# EAGLE design trackduino1309111914 (EAGLE 7.1.0)
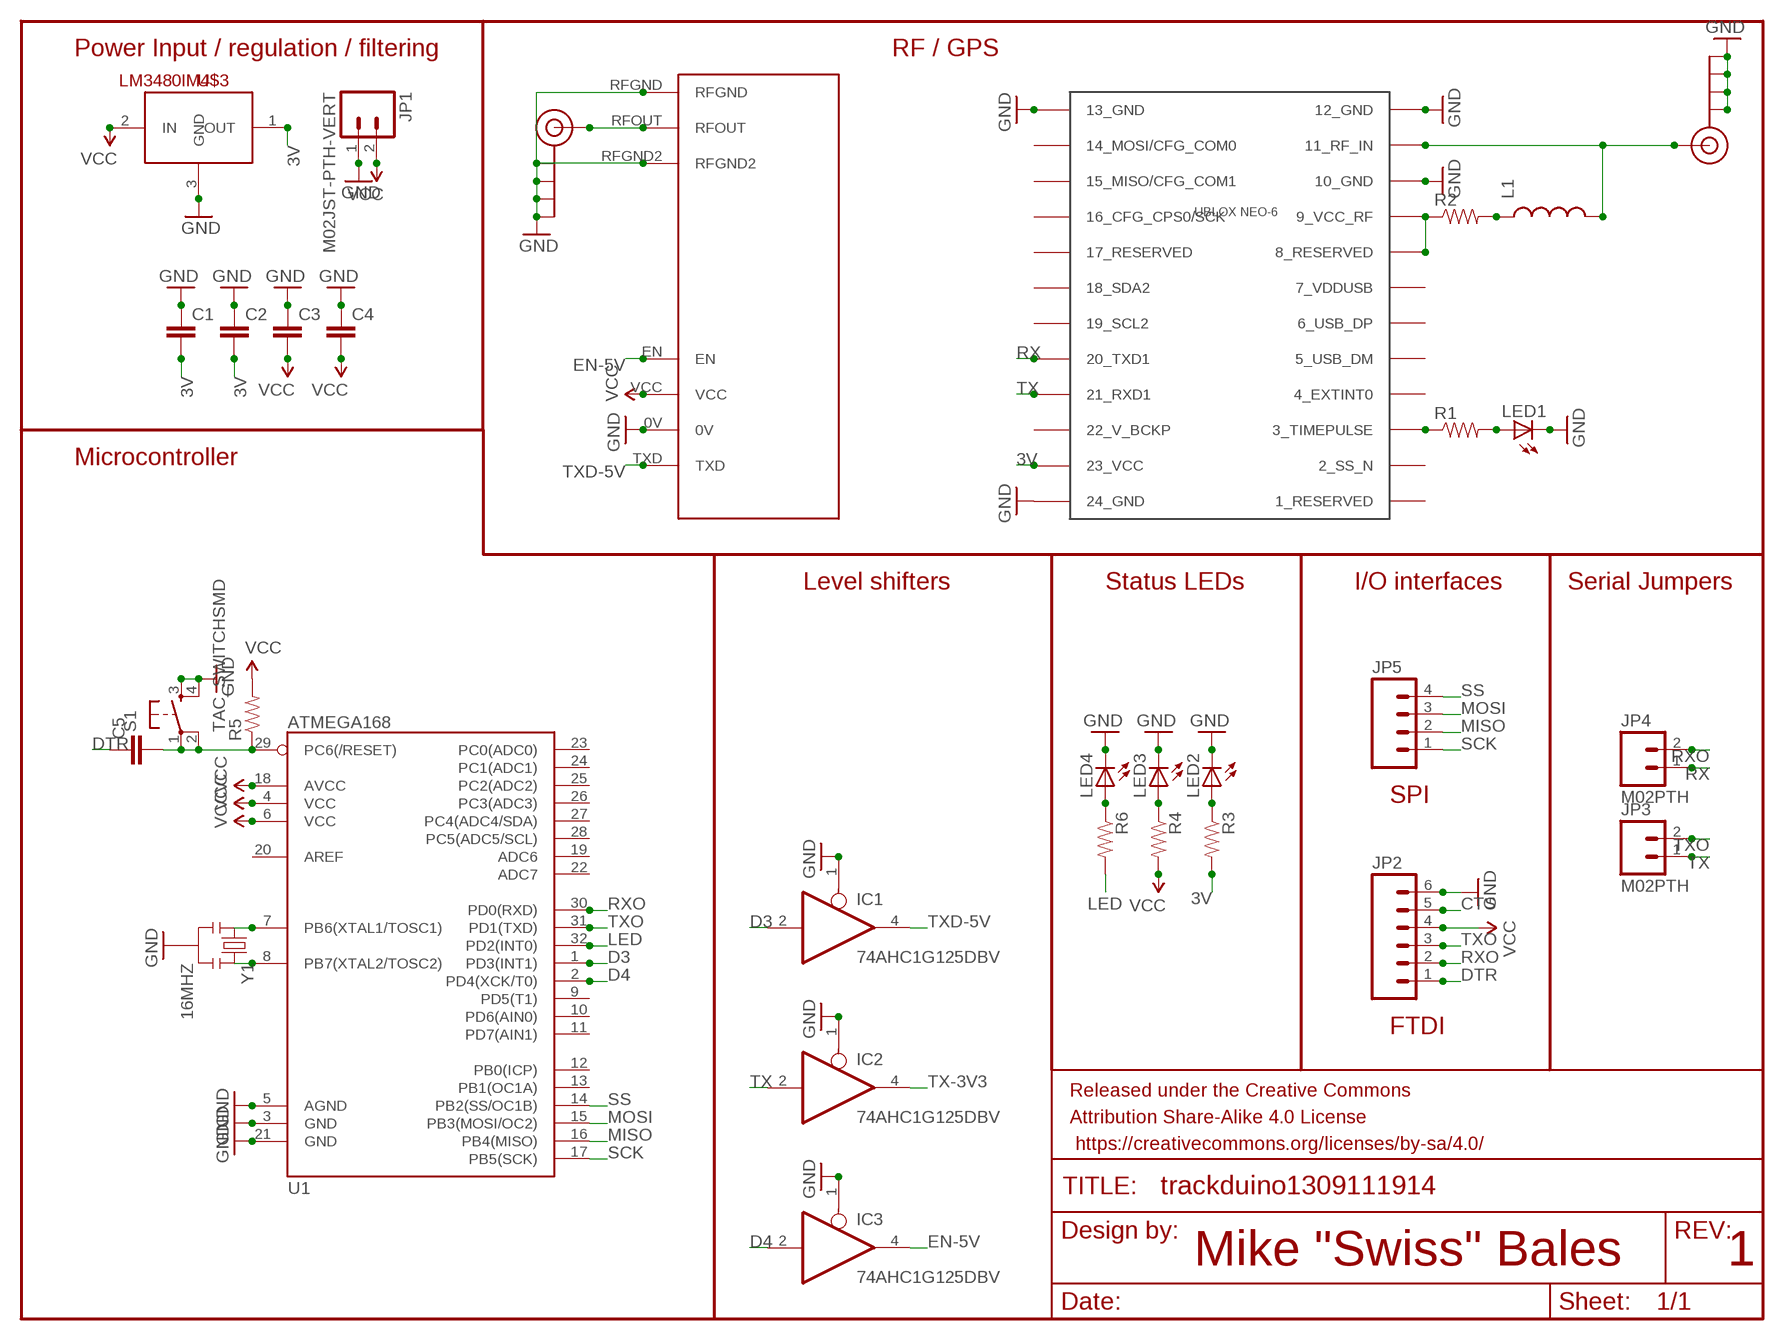
[diagram p0: schematic, sheet 1]

## Parts
C1  CAP0805  [0805]
C2  CAP0805  [0805]
C3  CAP0805  [0805]
C4  CAP0805  [0805]
C5  CAP0805  [0805]
FRAME1  FRAME-LETTER  [CREATIVE_COMMONS]
IC1  74AHC1G125DBV  [SOT23-5]
IC2  74AHC1G125DBV  [SOT23-5]
IC3  74AHC1G125DBV  [SOT23-5]
J$1  SMA_EDGE  [SMA-EDGE]
J$2  SMA_EDGE  [SMA-EDGE]
JP1  M02JST-PTH-VERT  [JST-2-PTH-VERT]
JP2  M06NO_SILK_FEMALE_PTH  [1X06_NO_SILK]
JP3  M02PTH  [1X02]
JP4  M02PTH  [1X02]
JP5  M041X04_NO_SILK  [1X04_NO_SILK]
L1  INDUCTOR0805  [0805]
LED1  LEDCHIP-LED0805  [CHIP-LED0805]
LED2  LEDCHIP-LED0805  [CHIP-LED0805]
LED3  LEDCHIP-LED0805  [CHIP-LED0805]
LED4  LEDCHIP-LED0805  [CHIP-LED0805]
R1  RESISTOR0805-RES  [0805]
R2  RESISTOR0805-RES  [0805]
R3  RESISTOR0805-RES  [0805]
R4  RESISTOR0805-RES  [0805]
R5  RESISTOR0805-RES  [0805]
R6  RESISTOR0805-RES  [0805]
S1  TAC_SWITCHSMD  [TACTILE-SWITCH-SMD]
U1  ATMEGA168  [TQFP32-08]
U$1  UBLOX_NEO-6  [UBLOX_NEO-6P]
U$2  RADIOMETRIX-HX1  [RADIOMETRIX-HX1]
U$3  LM3480IM4  [SOT23-3]
Y1  16MHZ  RESONATOR16MHZ  [RESONATOR-SMD]

## Nets
3V: C1.2 C2.2 R3.2 U$1.23_VCC U$3.1(OUT)
CTS: JP2.5
D3: IC1.2(I) U1.1(PD3(INT1))
D4: IC3.2(I) U1.2(PD4(XCK/T0))
DTR: C5.1 JP2.1
EN-5V: IC3.4(O) U$2.EN
GND: C1.1 C2.1 C3.1 C4.1 IC1.1(OE) IC2.1(OE) IC3.1(OE) J$1.GND@0(GND) J$1.GND@1(GND) J$1.GND@2(GND) J$1.GND@3(GND) J$2.GND@0(GND) J$2.GND@1(GND) J$2.GND@2(GND) J$2.GND@3(GND) JP1.1 JP2.6 LED1.C LED2.C LED3.C LED4.C S1.3 S1.4 U1.3(GND) U1.5(AGND) U1.21(GND) U$1.10_GND U$1.12_GND U$1.13_GND U$1.24_GND U$2.0V U$2.RFGND U$2.RFGND2 U$3.3(GND) Y1.2
LED: R6.2 U1.32(PD2(INT0))
MISO: JP5.2 U1.16(PB4(MISO))
MOSI: JP5.3 U1.15(PB3(MOSI/OC2))
N$1: J$1.SIG(SIGNAL) U$2.RFOUT
N$2: R1.1 U$1.3_TIMEPULSE
N$3: LED1.A R1.2
N$4: R2.1 U$1.8_RESERVED U$1.9_VCC_RF
N$5: L1.1 R2.2
N$6: J$2.SIG(SIGNAL) L1.2 U$1.11_RF_IN
N$7: LED2.A R3.1
N$8: LED3.A R4.1
N$9: C5.2 R5.1 S1.1 S1.2 U1.29(PC6(/RESET))
N$14: U1.8(PB7(XTAL2/TOSC2)) Y1.3
N$26: U1.7(PB6(XTAL1/TOSC1)) Y1.1
N$27: LED4.A R6.1
RX: JP4.1 U$1.20_TXD1
RXO: JP2.2 JP4.2 U1.30(PD0(RXD))
SCK: JP5.1 U1.17(PB5(SCK))
SS: JP5.4 U1.14(PB2(SS/OC1B))
TX: IC2.2(I) JP3.1 U$1.21_RXD1
TX-3V3: IC2.4(O)
TXD-5V: IC1.4(O) U$2.TXD
TXO: JP2.3 JP3.2 U1.31(PD1(TXD))
VCC: C3.2 C4.2 JP1.2 JP2.4 R4.2 R5.2 U1.4(VCC) U1.6(VCC) U1.18(AVCC) U$2.VCC U$3.2(IN)
Unconnected: U1.9(PD5(T1)) U1.10(PD6(AIN0)) U1.11(PD7(AIN1)) U1.12(PB0(ICP)) U1.13(PB1(OC1A)) U1.19(ADC6) U1.20(AREF) U1.22(ADC7) U1.23(PC0(ADC0)) U1.24(PC1(ADC1)) U1.25(PC2(ADC2)) U1.26(PC3(ADC3)) U1.27(PC4(ADC4/SDA)) U1.28(PC5(ADC5/SCL)) U$1.1_RESERVED U$1.2_SS_N U$1.4_EXTINT0 U$1.5_USB_DM U$1.6_USB_DP U$1.7_VDDUSB U$1.14_MOSI/CFG_COM0 U$1.15_MISO/CFG_COM1 U$1.16_CFG_CPS0/SCK U$1.17_RESERVED U$1.18_SDA2 U$1.19_SCL2 U$1.22_V_BCKP

## Notes on the sheet
- Power Input / regulation / filtering | RF / GPS
- Microcontroller
- Level shifters | Status LEDs | I/O interfaces | Serial Jumpers
- SPI
- FTDI
- Mike "Swiss" Bales | 1

## Power pins joined to a net without a drawn wire
GND: IC1.3(GND) IC2.3(GND) IC3.3(GND)
VCC: IC1.5(VCC) IC2.5(VCC) IC3.5(VCC)

## Library data of the parts
C1-C5 = SparkFun-Capacitors:CAP: Capacitor Standard 0603 ceramic capacitor, and 0.1" leaded capacitor.
FRAME1 = SparkFun-Aesthetics:FRAME-LETTER: Schematic Frame Standard 8.5x11 US Letter frame
IC1-IC3 = 74xx-little-us:74*1G125: Single Bus Buffer Gate with 3-State Output
J$1 J$2 = SparkFun-Connectors:SMA_EDGE: SMA Antenna Connector End launch SMA connector. The paste layer has been removed so that the connector can be hand soldered onto the board after reflow.
JP1 JP3 JP4 = SparkFun-Connectors:M02: Standard 2-pin 0.1" header. Use with - straight break away headers ( PRT-00116) - right angle break away headers (PRT-00553) - swiss pins (PRT-00743) - machine pins (PRT-00117) - female headers (PRT-00115) Molex polarized connector foot print use with: PRT-08233 with associated crimp pins and housings. 2.54_SCREWTERM for use with PRT-10571. 3.5mm Screw Terminal footprints for PRT-08084 5mm Screw Terminal footprints for use with PRT-08432
JP2 = SparkFun-Connectors:M06: Header 6 Standard 6-pin 0.1" header. Use with straight break away headers (SKU : PRT-00116), right angle break away headers (PRT-00553), swiss pins (PRT-00743), machine pins (PRT-00117), and female headers (PRT-00115). Molex polarized connector foot print use with SKU : PRT-08094 with associated crimp pins and housings. NOTES ON THE VARIANTS LOCK and LOCK_LONGPADS... This footprint was designed to help hold the alignment of a through-hole component (i.e. 6-pin header) while soldering it into place. You may notice that each hole has been shifted either up or down by 0.005 of an inch from it's more standard position (which is a perfectly straight line). This slight alteration caused the pins (the squares in the middle) to touch the edges of the holes. Because they are alternating, it causes a "brace" to hold the component in place. 0.005 has proven to be the perfect amount of "off-center" position when using our standard breakaway headers. Although looks a little odd when you look at the bare footprint, once you have a header in there, the alteration is very hard to notice. Also,if you push a header all the way into place, it is covered up entirely on the bottom side. This idea of altering the position of holes to aid alignment will be further integrated into the Sparkfun Library for other footprints. It can help hold any component with 3 or more connection pins.; PROD_ID: CONN-08437
JP5 = SparkFun-Connectors:M04: Header 4 Standard 4-pin 0.1" header. Use with straight break away headers (SKU : PRT-00116), right angle break away headers (PRT-00553), swiss pins (PRT-00743), machine pins (PRT-00117), and female headers (PRT-00115). Molex polarized connector foot print use with SKU : PRT-08231 with associated crimp pins and housings. 1MM SMD Version SKU: PRT-10208
L1 = SparkFun-Passives:INDUCTOR: Inductors Basic Inductor/Choke - 0603 and 1206. Footprints are not proven and vary greatly between part numbers. SRN6045- 33uH, 20% 1.4A SDR0403-560KL - 56uH, 10%, 500mA RMS/740mA peak
LED1-LED4 = adafruit:LED: LED OSRAM: - CHIPLED LG R971, LG N971, LY N971, LG Q971, LY Q971, LO R971, LY R971 LH N974, LH R974 LS Q976, LO Q976, LY Q976 LO Q996 - Hyper CHIPLED LW Q18S LB Q993, LB Q99A, LB R99A - SideLED LS A670, LO A670, LY A670, LG A670, LP A670 LB A673, LV A673, LT A673, LW A673 LH A674 LY A675 LS A676, LA A676, LO A676, LY A676, LW A676 LS A679, LY A679, LG A679 - Hyper Micro SIDELED® LS Y876, LA Y876, LO Y876, LY Y876 LT Y87S - SmartLED LW L88C, LW L88S LB L89C, LB L89S, LG L890 LS L89K, LO L89K, LY L89K LS L896, LA L896, LO L896, LY L896 - TOPLED LS T670, LO T670, LY T670, LG T670, LP T670 LSG T670, LSP T670, LSY T670, LOP T670, LYG T670 LG T671, LOG T671, LSG T671 LB T673, LV T673, LT T673, LW T673 LH T674 LS T676, LA T676, LO T676, LY T676, LB T676, LH T676, LSB T676, LW T676 LB T67C, LV T67C, LT T67C, LS T67K, LO T67K, LY T67K, LW E67C LS E67B, LA E67B, LO E67B, LY E67B, LB E67C, LV E67C, LT E67C LW T67C LS T679, LY T679, LG T679 LS T770, LO T770, LY T770, LG T770, LP T770 LB T773, LV T773, LT T773, LW T773 LH T774 LS E675, LA E675, LY E675, LS T675 LS T776, LA T776, LO T776, LY T776, LB T776 LHGB T686 LT T68C, LB T68C - Hyper Mini TOPLED® LB M676 - Mini TOPLED Santana® LG M470 LS M47K, LO M47K, LY M47K Source: http://www.osram.convergy.de/
R1-R6 = SparkFun-Resistors:RESISTOR: Resistor Basic schematic elements and footprints for 0603, 1206, and PTH resistors.
S1 = SparkFun-Electromechanical:TAC_SWITCH: Momentary Switch Button commonly used for reset or general input. Spark Fun Electronics SKU : COM-00097 SMT- SWCH-08247; PROD_ID: SWCH-08247
U1 = SparkFun-DigitalIC:ATMEGA168: Atmel 32-pin 8-bit micro, 16k flash.
U$1 = Ava:UBLOX_NEO-6: UBLOX NEO-6 GPS MODULE Author Anthony Stirk / http://ava.upuaut.net http://www.u-blox.com/images/downloads/Product_Docs/LEA-6_NEO-6_MAX_HardwareIntegrationManual_%28GPS.G6-HW-09007%29.pdf http://www.u-blox.com/images/downloads/Product_Docs/NEO-6_DataSheet_%28GPS.G6-HW-09005%29.pdf
U$2 = Ava:RADIOMETRIX-HX1
U$3 = SparkFun-PowerIC:LM3480IM4: Small package linear regulator
Y1 = SparkFun-FreqCtrl:RESONATOR: Resonator Small SMD resonator. Used, eg, on the Arduino Pro/ Pro Mini boards. 8MHz- XTAL-08895 16MHz- XTAL-08900; PROD_ID: XTAL-08900

## Board
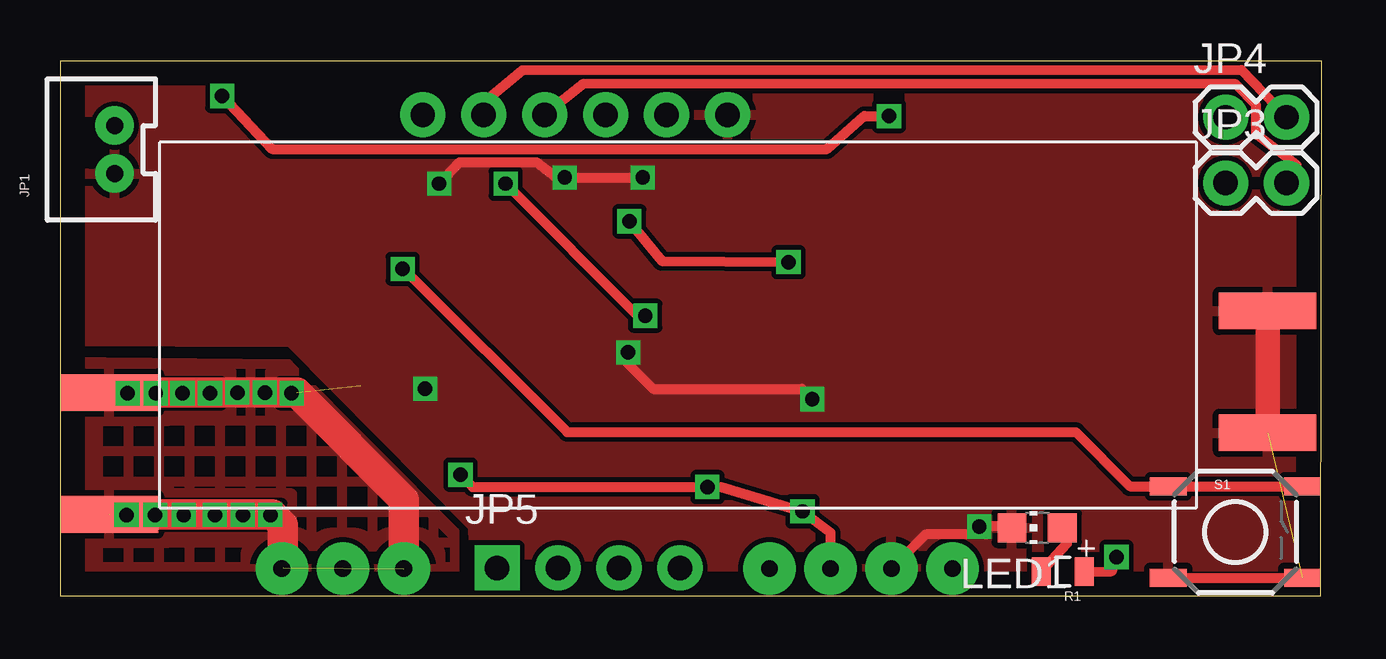
[diagram p1: board, top side]
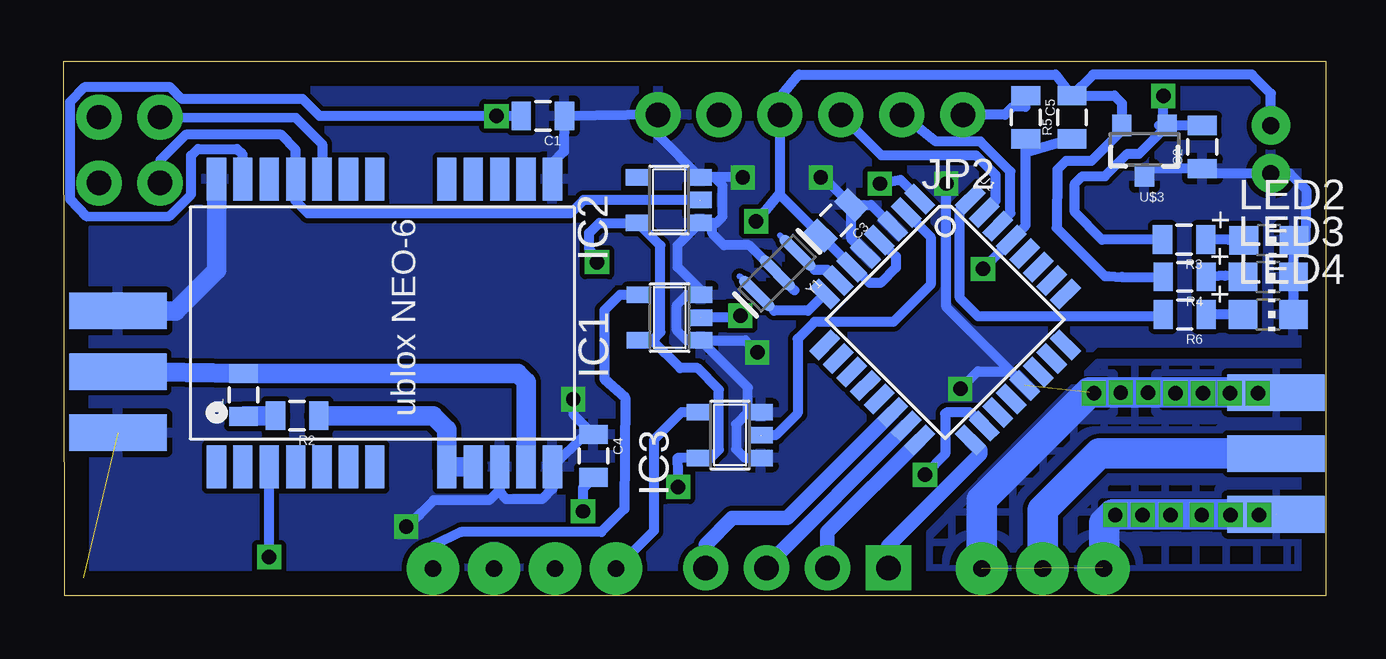
[diagram p2: board, bottom side, seen from below]

Size 52.58 x 22.29 mm. Coordinates in mm from the lower left corner, seen from the top.
Outline: 0,0 52.53,0 52.58,22.29 0,22.29 0,0
Copper layers (1*16): Top 0.035mm / dielectric 1.5mm / Bottom 0.035mm
Design rules "default": minimum track width 10mil, minimum drill 24mil, track to track 8mil, track to pad 8mil, pad to pad 8mil, via to via 8mil, smd to smd 8mil, copper to edge 40mil, drill to drill 8mil, minimum pad ring 10mil, minimum via ring 8mil, stop-mask expansion 4mil, vias tented up to drill 0mil, thermal gap 10mil

### Footprints (pad centres in the part's own frame; a part is rotated, then mirrored left to right if it is on the bottom)
0805 = smd 0.8 x 1.2: 1 -0.9,0; 2 0.9,0
SOT23-5 = smd 0.69 x 0.99: 1 -0.95,-1.29; 2 0,-1.29; 3 0.95,-1.29; 4 0.95,1.3; 5 -0.95,1.3
SMA-EDGE = smd 1.524 x 4.064: GND@0 0,0; GND@1 5.08,0; SIG 2.54,0 | smd 1.524 x 4.064 bottom: GND@2 0,0; GND@3 5.08,0
JST-2-PTH-VERT = drill 0.7 pad 1.6: 1 -1,-0.55; 2 1,-0.55
1X06_NO_SILK = drill 1.016 pad 1.88: 1 0,0; 2 2.54,0; 3 5.08,0; 4 7.62,0; 5 10.16,0; 6 12.7,0
1X02 = drill 1.016 pad 1.88: 1 0,0; 2 2.54,0
1X04_NO_SILK = drill 1.016 pad 1.88 square: 1 0,0 | drill 1.016 pad 1.88: 2 2.54,0; 3 5.08,0; 4 7.62,0
CHIP-LED0805 = smd 1.2 x 1.2: A 0,-1.05; C 0,1.05
TACTILE-SWITCH-SMD = smd 1.524 x 0.762: 1 -2.794,1.905; 2 2.794,1.905; 3 -2.794,-1.905; 4 2.794,-1.905
TQFP32-08 = smd 1.27 x 0.559: 1 -4.293,2.8; 2 -4.293,2; 3 -4.293,1.2; 4 -4.293,0.4; 5 -4.293,-0.4; 6 -4.293,-1.2; 7 -4.293,-2; 8 -4.293,-2.8; 17 4.293,-2.8; 18 4.293,-2; 19 4.293,-1.2; 20 4.293,-0.4; 21 4.293,0.4; 22 4.293,1.2; 23 4.293,2; 24 4.293,2.8 | smd 0.559 x 1.27: 9 -2.8,-4.293; 10 -2,-4.293; 11 -1.2,-4.293; 12 -0.4,-4.293; 13 0.4,-4.293; 14 1.2,-4.293; 15 2,-4.293; 16 2.8,-4.293; 25 2.8,4.293; 26 2,4.293; 27 1.2,4.293; 28 0.4,4.293; 29 -0.4,4.293; 30 -1.2,4.293; 31 -2,4.293; 32 -2.8,4.293
UBLOX_NEO-6P = smd 1.8 x 0.8: 1_RESERVED 6.4,-7.4; 2_SS_N 6.4,-6.3; 3_TIMEPULSE 6.4,-5.2; 4_EXTINT0 6.4,-4.1; 5_USB_DM 6.4,-3; 6_USB_DP 6.4,-1.9; 7_VDDUSB 6.4,-0.8; 8_RESERVED 6.4,2.2; 9_VCC_RF 6.4,3.3; 10_GND 6.4,4.4; 11_RF_IN 6.4,5.5; 12_GND 6.4,6.6; 13_GND -5.6,6.6; 14_MOSI/CFG_COM0 -5.6,5.5; 15_MISO/CFG_COM1 -5.6,4.4; 16_CFG_CPS0/SCK -5.6,3.3; 17_RESERVED -5.6,2.2; 18_SDA2 -5.6,-0.8; 19_SCL2 -5.6,-1.9; 20_TXD1 -5.6,-3; 21_RXD1 -5.6,-4.1; 22_V_BCKP -5.6,-5.2; 23_VCC -5.6,-6.3; 24_GND -5.6,-7.4
RADIOMETRIX-HX1 = drill 0.7 pad 2.184: 0V 8.89,-10.16; EN 3.81,-10.16; RFGND -11.43,-10.16; RFGND2 -16.51,-10.16; RFOUT -13.97,-10.16; TXD 11.43,-10.16; VCC 6.35,-10.16
SOT23-3 = smd 0.8 x 0.9: 1 -0.95,-1; 2 0.95,-1; 3 0,1.1
RESONATOR-SMD = smd 0.45 x 1.905: 1 -1.2,0; 2 0,0; 3 1.2,0

### Placement (x,y rotation side)
C1  32.61,20.02 180 bottom
C2  5.13,18.72 90 bottom
C3  20.4,15.67 225 bottom
C4  30.51,5.84 270 bottom
C5  12.5,19.96 270 bottom
FRAME1  19.1,-8.1 0 top  (outside the outline)
IC1  27.33,11.61 90 bottom
IC2  27.36,16.51 90 bottom
IC3  24.82,6.71 90 bottom
J$1  2.06,3.4 90 bottom
J$2  50.32,6.81 90 bottom
JP1  1.73,18.62 90 top
JP2  15.11,20.07 180 bottom
JP3  48.56,17.22 0 top
JP4  48.56,19.96 0 top
JP5  18.21,1.17 0 top
L1  45.09,8.38 90 bottom
LED1  40.72,2.84 90 top
LED2  2.36,14.83 270 bottom
LED3  2.39,13.31 270 bottom
LED4  2.39,11.73 270 bottom
R1  41.78,1.02 180 top
R2  42.85,7.52 180 bottom
R3  5.89,14.86 180 bottom
R4  5.87,13.31 180 bottom
R5  10.57,19.96 90 bottom
R6  5.87,11.73 180 bottom
S1  48.97,2.67 0 top
U1  15.85,11.53 315 bottom
U$1  38.81,11.79 270 bottom
U$2  25.76,11.3 0 top
U$3  7.54,18.62 180 bottom
Y1  22.85,13.46 225 bottom

### Tracks (layer width: path | path; a pad name or v marks a point on that pad's centre or on a via)
3V  (via drill 0.6)
  Top 0.406: v6.76,20.85 8.84,18.64 31.96,18.64 C1.2 v34.54,20.02
  Bottom 0.406: C2.2 U$3.1 | U$3.1 7.77,18.44 8.26,18.44 9.2,17.5 10.13,17.5 10.44,17.2 10.44,16 9.32,14.86 R3.2 | C1.2 v34.54,20.02 41.91,20.02 42.62,20.73 47.65,20.73 48.13,21.21 51.71,21.21 52.32,20.6 52.32,16.56 51.61,15.82 48.16,15.85 47.27,16.74 47.27,18.36 46.99,18.64 45.36,18.64 45.14,18.42 45.14,17.41 U$1.23_VCC | U$3.1 6.95,19.62 | U$3.1 6.76,19.78 v6.76,20.85
D3  (via drill 0.6)
  Top 0.406: v18.57,17.2 24.08,11.68 v24.38,11.68
  Bottom 0.406: U1.1 17.71,17.35 v18.57,17.2 | v24.38,11.68 24.82,11.61 IC1.2
D4
  Bottom 0.406: U1.2 16.46,14.97 16.46,12.98 18.01,11.43 21.29,11.43 22,10.72 22,7.62 22.91,6.71 IC3.2
DTR
  Bottom 0.406: C5.1 12.51,20.4 13.03,20.4 13.36,20.07 JP2.1
EN-5V
  Bottom 0.406: IC3.4 26.84,7.66 27.99,6.5 27.99,2.72 U$2.EN
GND  (via drill 0.6)  (5 unrouted)
  Top 0.406: LED1.C 39.01,2.9 v38.3,2.9 38.58,2.57 36.07,2.57 U$2.0V | v24.28,17.45 v21.03,17.45 20.7,17.45 19.86,18.09 16.64,18.09 v15.8,17.2 | v23.67,10.16 23.67,9.68 24.71,8.64 30.91,8.64 v31.34,8.2 | S1.3 S1.4 | v15.21,8.64
  Top 1.016: J$2.GND@3 J$2.GND@2
  Top 1.27: J$1.GND@2 8.84,3.4 9.27,2.97 9.27,1.19 9.3,1.17 | J$1.GND@1 v7.39,8.48 v8.53,8.48 9.86,8.48 14.33,4.01 14.33,1.22 14.38,1.17
  Bottom 0.406: U$3.3 7.24,17.82 C2.1 4.93,17.62 JP1.1 1.49,17.62 0.81,16.94 0.84,14.8 LED2.C 1.34,13.84 LED3.C LED4.C | C3.1 18.93,16.31 U1.3 | U$1.13_GND 32.21,18.06 31.74,18.53 C1.1 JP2.6 27.81,19.21 IC2.3 25.48,17.46 | v38.3,2.9 37.72,3.43 37.72,3.45 38.58,2.59 38.58,2.57 37.16,3.99 34.85,3.99 34.41,4.43 U$1.10_GND 34.42,4.32 34.14,4.04 32.64,4.04 32.21,4.47 U$1.12_GND 30.86,6.74 C4.1 31.34,7.58 v31.34,8.2 | C3.1 20.9,17.45 v21.03,17.45 | v24.28,17.45 24.29,17.46 25.48,17.46 | IC3.3 24.07,7.66 | 24.07,7.66 24.56,7.16 24.56,6.12 24.21,5.77 IC3.1 | 24.07,7.66 24.07,8.69 IC1.1 | IC1.1 26.61,10.66 27.03,11.07 27.03,12.14 26.62,12.55 IC1.3 26.04,12.76 27,13.72 27,14.63 IC2.1 25.55,15.56 | 25.55,15.56 25.39,15.56 25.12,15.82 25.12,17.1 25.48,17.46 | U1.21 13.12,9.36 | 13.12,9.36 15.8,12.05 v15.8,17.2 | IC1.1 24.17,10.66 v23.67,10.16 | v15.21,8.64 14.49,9.36 13.12,9.36 | U1.5 19.76,14.88 C3.1 | 22.13,12.75 24.02,14.63 25.07,14.63 25.55,15.11 25.55,15.56
  Bottom 0.813: J$2.GND@3 47.9,11.89 46.2,13.59 U$1.24_GND
  Bottom 1.27: J$1.GND@2 8.86,3.4 9.22,3.05 9.22,1.17 U$2.RFGND2 | J$1.GND@1 v7.39,8.48 v8.53,8.48 9.86,8.48 14.33,4.01 U$2.RFGND
  pour Top: -0.03,22.61 52.53,22.56 52.53,-0.43 17.32,-0.43 17.22,2.87 9.6,10.57 0,10.62
  pour Bottom: 0,22.56 52.53,22.56 52.53,-0.43 17.42,-0.43 17.27,-0.28 17.27,2.84 9.55,10.57 0.03,10.57
  pour Top (hatched): 0.03,9.78 9.5,9.68 16.43,2.69 16.43,-0.43 0.03,-0.33
  pour Bottom (hatched): 0.05,9.73 9.5,9.73 16.48,2.64 16.48,-0.41 0.05,-0.43
LED
  Bottom 0.406: R6.2 6.84,11.66 14.48,11.66 15.24,12.42 15.24,16.1 U1.32
MISO
  Bottom 0.61: U1.16 20.75,2.67 JP5.2
MOSI
  Bottom 0.61: U1.15 23.29,1.26 JP5.3
N$1
  Bottom 1.27: J$1.SIG 9.42,5.94 11.79,3.58 U$2.RFOUT
N$2  (via drill 0.6)
  Top 0.406: R1.1 43.83,1.03 v44.02,1.63
  Bottom 0.406: v44.02,1.63 U$1.3_TIMEPULSE
N$3
  Top 0.406: LED1.A 41.95,2.18 R1.2
N$4
  Bottom 0.813: U$1.9_VCC_RF U$1.8_RESERVED 36.61,6.94 37.19,7.52 R2.1
N$5
  Bottom 0.813: R2.2 45.05,7.52 L1.1
N$6
  Bottom 0.813: U$1.11_RF_IN 33.31,8.93 33.66,9.27 45.07,9.27 L1.2 49.95,9.36 J$2.SIG
N$7
  Bottom 0.406: LED2.A 4.05,14.86 R3.1
N$8
  Bottom 0.406: LED3.A 4.18,13.36 R4.1
N$9  (via drill 0.6)
  Top 0.406: v14.28,13.64 14.33,13.64 21.13,6.83 42.32,6.83 44.58,4.57 S1.1 S1.2
  Bottom 0.406: R5.1 12.42,18.53 C5.2 12.5,15.45 U1.29 13.1,14.82 v14.28,13.64
N$12  (via drill 0.6)
  other vias: 2.82,8.46
N$13  (via drill 0.6)
  other vias: 2.77,3.38
N$14
  Bottom 0.406: U1.8 21.55,11.9 22.98,11.9
N$17  (via drill 0.6)
  other vias: 3.96,3.38
N$18  (via drill 0.6)
  other vias: 5.16,3.38
N$19  (via drill 0.6)
  other vias: 6.45,3.38
N$20  (via drill 0.6)
  other vias: 7.62,3.38
N$21  (via drill 0.6)
  other vias: 8.76,3.38
N$22  (via drill 0.6)
  other vias: 3.99,8.46
N$23  (via drill 0.6)
  other vias: 5.11,8.46
N$24  (via drill 0.6)
  other vias: 6.25,8.46
N$25  (via drill 0.6)
  other vias: 9.65,8.46
N$26
  Bottom 0.406: U1.7 20.74,13.59 21.28,13.59
N$27
  Bottom 0.406: LED4.A R6.1
RX
  Bottom 0.406: JP4.1 42.9,19.94 41.81,18.85 U$1.20_TXD1
RXO
  Top 0.406: JP2.2 17.65,20.6 19.25,21.92 49.23,21.95 JP4.2
  Bottom 0.406: U1.30 13.13,15.95 13.13,17.7 14.38,18.95 16.23,18.95 JP2.2
SCK
  Bottom 0.61: U1.17 14.38,6.1 14.38,5.92 18.21,2.08 JP5.1
SS
  Bottom 0.61: U1.14 22.43,3.25 24.71,3.25 25.83,2.13 JP5.4
TX
  Bottom 0.406: JP3.1 48.54,17.6 48.54,18.19 47.5,19.23 43.51,19.23 42.91,18.6 U$1.21_RXD1 42.93,17.37 42.93,16.48 42.39,15.95 31.47,15.95 30.91,16.51 IC2.2
TXD-5V
  Bottom 0.406: IC1.4 29.4,12.56 30.05,11.91 30.05,9.04 29.18,8.28 29.21,3.63 30.18,2.67 36.02,2.67 37.16,2.11 37.16,1.17 U$2.TXD
TXO
  Top 0.406: JP3.2 51.51,17.98 49.84,19.25 49.84,20.47 49,21.34 21.82,21.36 JP2.3
  Bottom 0.406: U1.31 13.74,16.47 13.74,17.55 14.55,18.36 18.49,18.36 JP2.3
VCC  (via drill 0.6)
  Top 0.406: v23.72,15.62 25.07,13.97 v30.35,13.92 | U$2.VCC 32.11,2.64 v30.94,3.53 27.56,4.55 v26.98,4.55 17.2,4.55 v16.69,5.05
  Bottom 0.406: U1.4 17.91,14.15 17.91,13.69 18.54,13.06 19,13.06 19.66,13.72 U1.6 19.73,13.74 C3.2 22.73,16.74 | R5.2 11.24,21.74 21.95,21.74 22.73,20.78 JP2.4 22.73,16.74 | IC1.5 28.05,10.66 | 28.05,10.66 27.71,11 27.71,14.62 IC2.5 30.26,15.56 30.68,15.14 30.68,14.48 v30.35,13.92 | 28.05,10.66 26.89,9.5 26.16,9.5 25.27,8.61 25.27,6.1 25.61,5.76 IC3.5 27.01,5.76 v26.98,4.55 | 22.73,16.74 22.83,16.69 v23.72,15.62 | v30.94,3.53 30.94,4.51 C4.2 | JP1.2 2.28,20.95 3.07,21.74 9.69,21.74 R5.2 | R5.2 8.8,20.86 8.48,20.55 8.48,19.63 U$3.2 8.49,19.4 9.75,18.14 10.82,18.14 11.18,17.78 11.2,15.34 9.2,13.34 9.04,13.34 8.48,13.31 R4.2 | U1.18 14.79,7.65 15.8,7.65 15.85,7.59 15.85,5.92 16.69,5.08 v16.69,5.05